# Altium schematic sheet Array.SchDoc
size A
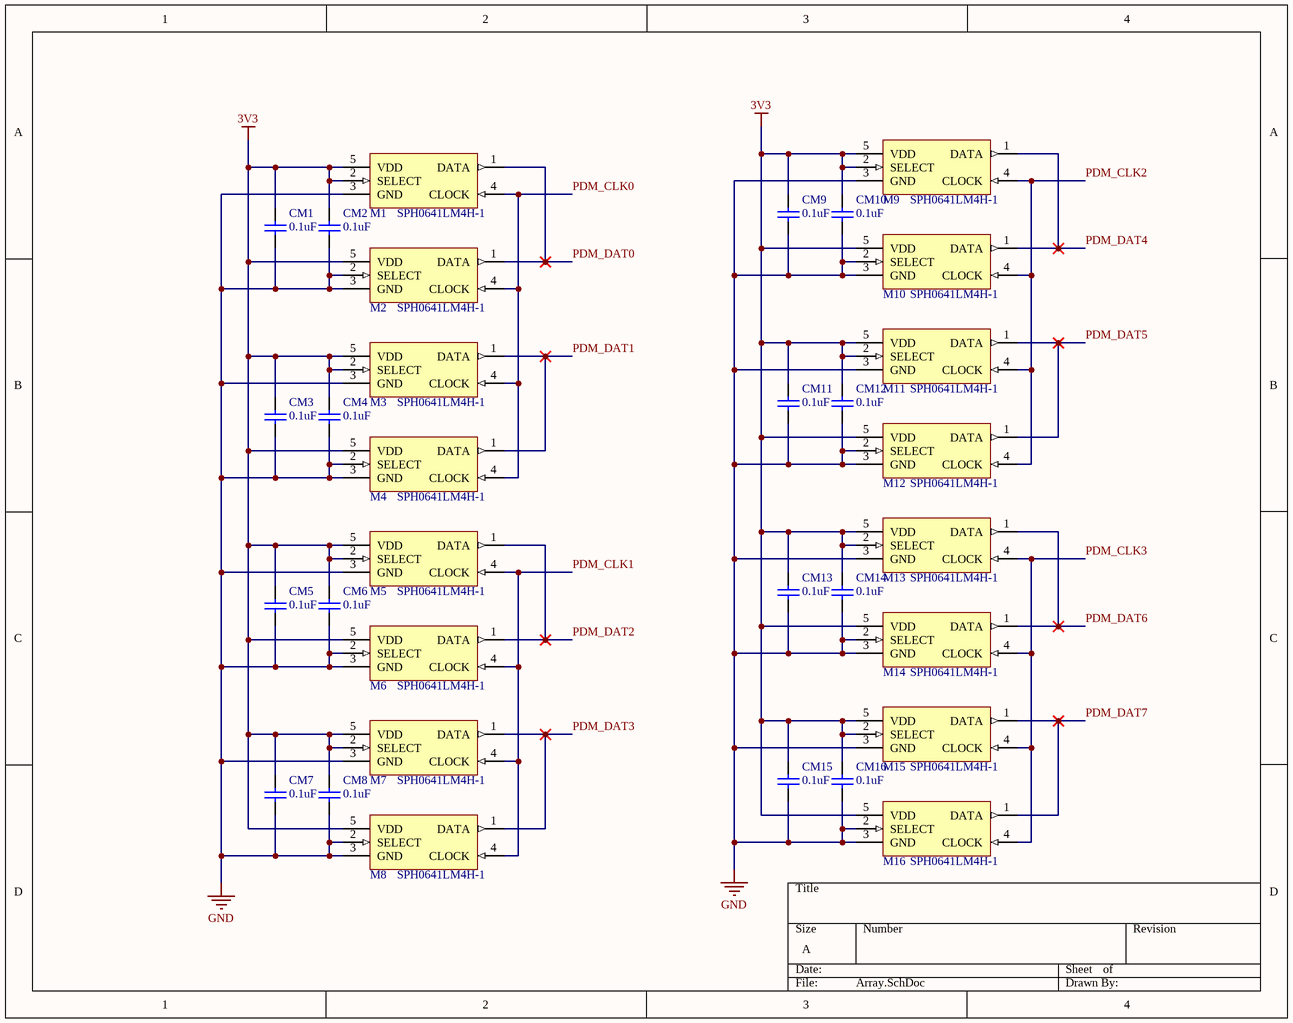
[diagram p0: Array.SchDoc]

## Parts
CM1  0.1uF  [CHIP-0603]
CM2  0.1uF  [CHIP-0603]
CM3  0.1uF  [CHIP-0603]
CM4  0.1uF  [CHIP-0603]
CM5  0.1uF  [CHIP-0603]
CM6  0.1uF  [CHIP-0603]
CM7  0.1uF  [CHIP-0603]
CM8  0.1uF  [CHIP-0603]
CM9  0.1uF  [CHIP-0603]
CM10  0.1uF  [CHIP-0603]
CM11  0.1uF  [CHIP-0603]
CM12  0.1uF  [CHIP-0603]
CM13  0.1uF  [CHIP-0603]
CM14  0.1uF  [CHIP-0603]
CM15  0.1uF  [CHIP-0603]
CM16  0.1uF  [CHIP-0603]
M1  SPH0641LM4H-1  [SPH0641LM4H-1_KNO]
M2  SPH0641LM4H-1  [SPH0641LM4H-1_KNO]
M3  SPH0641LM4H-1  [SPH0641LM4H-1_KNO]
M4  SPH0641LM4H-1  [SPH0641LM4H-1_KNO]
M5  SPH0641LM4H-1  [SPH0641LM4H-1_KNO]
M6  SPH0641LM4H-1  [SPH0641LM4H-1_KNO]
M7  SPH0641LM4H-1  [SPH0641LM4H-1_KNO]
M8  SPH0641LM4H-1  [SPH0641LM4H-1_KNO]
M9  SPH0641LM4H-1  [SPH0641LM4H-1_KNO]
M10  SPH0641LM4H-1  [SPH0641LM4H-1_KNO]
M11  SPH0641LM4H-1  [SPH0641LM4H-1_KNO]
M12  SPH0641LM4H-1  [SPH0641LM4H-1_KNO]
M13  SPH0641LM4H-1  [SPH0641LM4H-1_KNO]
M14  SPH0641LM4H-1  [SPH0641LM4H-1_KNO]
M15  SPH0641LM4H-1  [SPH0641LM4H-1_KNO]
M16  SPH0641LM4H-1  [SPH0641LM4H-1_KNO]

## Nets
3V3: CM1.2 CM2.2 CM3.2 CM4.2 CM5.2 CM6.2 CM7.2 CM8.2 CM9.2 CM10.2 CM11.2 CM12.2 CM13.2 CM14.2 CM15.2 CM16.2 M1.2(SELECT) M1.5(VDD) M2.5(VDD) M3.2(SELECT) M3.5(VDD) M4.5(VDD) M5.2(SELECT) M5.5(VDD) M6.5(VDD) M7.2(SELECT) M7.5(VDD) M8.5(VDD) M9.2(SELECT) M9.5(VDD) M10.5(VDD) M11.2(SELECT) M11.5(VDD) M12.5(VDD) M13.2(SELECT) M13.5(VDD) M14.5(VDD) M15.2(SELECT) M15.5(VDD) M16.5(VDD)
GND: CM1.1 CM2.1 CM3.1 CM4.1 CM5.1 CM6.1 CM7.1 CM8.1 CM9.1 CM10.1 CM11.1 CM12.1 CM13.1 CM14.1 CM15.1 CM16.1 M1.3(GND) M2.2(SELECT) M2.3(GND) M3.3(GND) M4.2(SELECT) M4.3(GND) M5.3(GND) M6.2(SELECT) M6.3(GND) M7.3(GND) M8.2(SELECT) M8.3(GND) M9.3(GND) M10.2(SELECT) M10.3(GND) M11.3(GND) M12.2(SELECT) M12.3(GND) M13.3(GND) M14.2(SELECT) M14.3(GND) M15.3(GND) M16.2(SELECT) M16.3(GND)
PDM_CLK0: M1.4(CLOCK) M2.4(CLOCK) M3.4(CLOCK) M4.4(CLOCK)
PDM_CLK1: M5.4(CLOCK) M6.4(CLOCK) M7.4(CLOCK) M8.4(CLOCK)
PDM_CLK2: M9.4(CLOCK) M10.4(CLOCK) M11.4(CLOCK) M12.4(CLOCK)
PDM_CLK3: M13.4(CLOCK) M14.4(CLOCK) M15.4(CLOCK) M16.4(CLOCK)
PDM_DAT0: M1.1(DATA) M2.1(DATA)
PDM_DAT1: M3.1(DATA) M4.1(DATA)
PDM_DAT2: M5.1(DATA) M6.1(DATA)
PDM_DAT3: M7.1(DATA) M8.1(DATA)
PDM_DAT4: M9.1(DATA) M10.1(DATA)
PDM_DAT5: M11.1(DATA) M12.1(DATA)
PDM_DAT6: M13.1(DATA) M14.1(DATA)
PDM_DAT7: M15.1(DATA) M16.1(DATA)

## Library data of the parts
CM1-CM16 = Cap: Capacitor; Published: 8-Jun-2000; LatestRevisionDate: 17-Jul-2002; LatestRevisionNote: Re-released for DXP Platform.; PackageReference: RAD-0.3; Publisher: Altium Limited; PackageDescription: Radial Cap, Thru-Hole; 2 Leads; 0.3 in Pin Spacing
M1-M16 = SPH0641LM4H-1: No Description Available; Mfr_Name: Knowles; Copyright: Copyright (C) 2023 Ultra Librarian. All rights reserved.; Manufacturer_Part_Number: SPH0641LM4H-1; RefDes: RefDes; Type: DEV